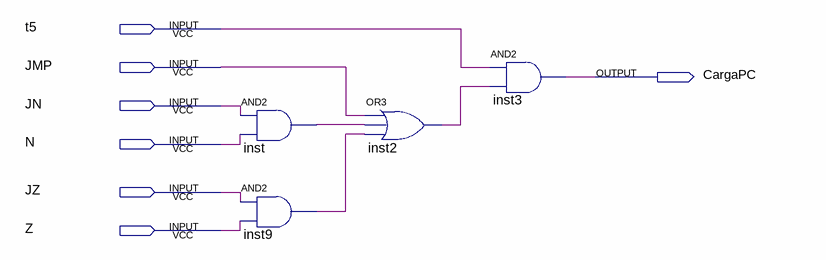
[diagram p0: schematic sheet]
// Quartus schematic CargaPC.bdf as structural Verilog: 4 symbols, 7 pins
module CargaPC (
  input  t5,
  input  JMP,
  input  JN,
  input  N,
  input  JZ,
  input  Z,
  output CargaPC
);

  wire inst2_out, inst9_out, inst_out;

  and inst (inst_out, JN, N);
  and inst9 (inst9_out, JZ, Z);
  or inst2 (inst2_out, JMP, inst_out, inst9_out);
  and inst3 (CargaPC, t5, inst2_out);
endmodule
